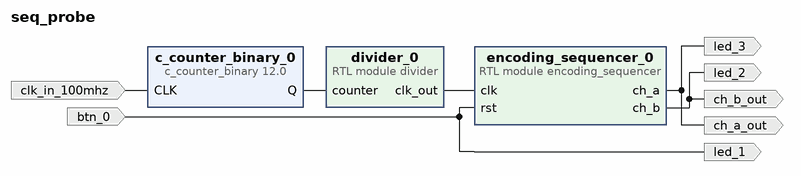
[diagram p0: block diagram of the top level]
# Vivado block design seq_probe, xc7a35ticsg324-1L, Vivado 2023.1
create_bd_design seq_probe

create_bd_port -dir I -type data btn_0
create_bd_port -dir O -type data led_1
create_bd_port -dir I clk_in_100mhz
create_bd_port -dir O -type data ch_a_out
create_bd_port -dir O -type data ch_b_out
create_bd_port -dir O led_3
create_bd_port -dir O led_2

create_bd_cell -type ip -vlnv xilinx.com:ip:c_counter_binary:12.0 c_counter_binary_0
set_property -dict {CONFIG.Output_Width 32} [get_bd_cells c_counter_binary_0]
create_bd_cell -type module -reference divider divider_0
create_bd_cell -type module -reference encoding_sequencer encoding_sequencer_0

# ---- connections ----

connect_bd_net -net btn_0_1 [get_bd_ports btn_0] [get_bd_ports led_1] [get_bd_pins encoding_sequencer_0/rst]
connect_bd_net [get_bd_pins c_counter_binary_0/Q] [get_bd_pins divider_0/counter]
connect_bd_net [get_bd_ports clk_in_100mhz] [get_bd_pins c_counter_binary_0/CLK]
connect_bd_net [get_bd_pins divider_0/clk_out] [get_bd_pins encoding_sequencer_0/clk]
connect_bd_net [get_bd_pins encoding_sequencer_0/ch_a] [get_bd_ports ch_a_out] [get_bd_ports led_3]
connect_bd_net [get_bd_pins encoding_sequencer_0/ch_b] [get_bd_ports ch_b_out] [get_bd_ports led_2]

validate_bd_design
save_bd_design
